# Altium schematic sheet CM_POWER_TREE.SchDoc
size Tabloid; SheetNumber: 2; SheetTotal: 14; Sheet_Name: Power tree
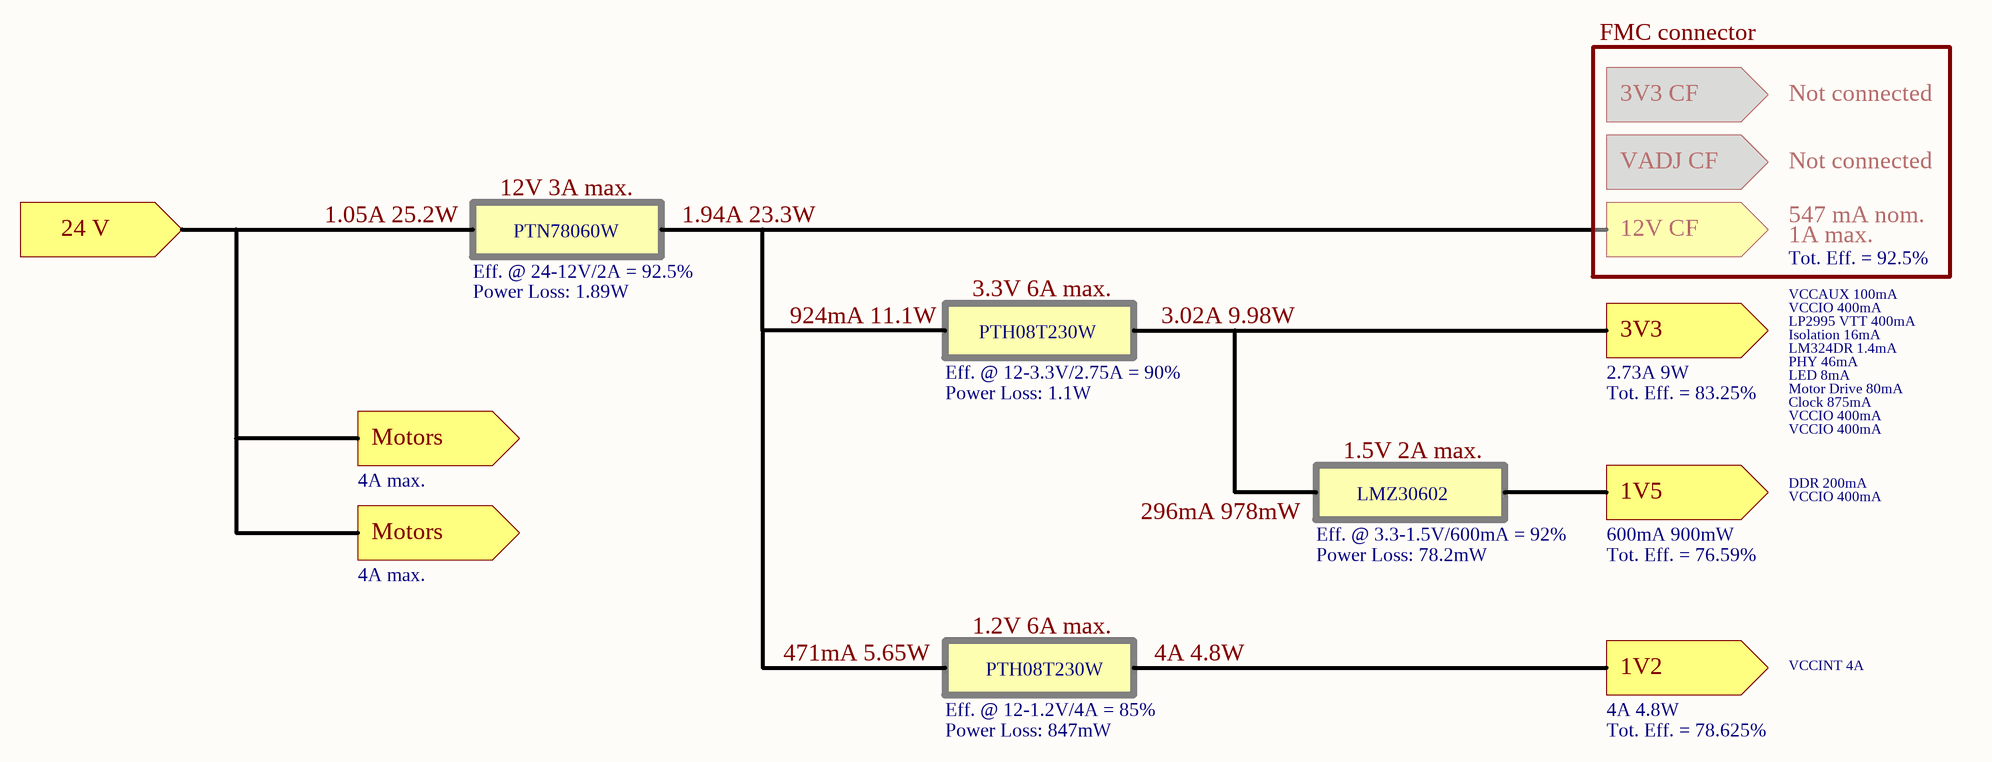
[diagram p0: CM_POWER_TREE.SchDoc]

## Notes on the sheet
- FMC connector
- 3V3 CF
- Not connected
- 12V 3A max.
- VADJ CF
- 24 V
- 1.05A 25.2W
- PTN78060W
- 1.94A 23.3W
- 12V CF
- 1A max.
- 547 mA nom.
- Tot. Eff. = 92.5%
- Eff. @ 24-12V/2A = 92.5%
- Power Loss: 1.89W
- 924mA 11.1W
- 3.3V 6A max.
- PTH08T230W
- 3.02A 9.98W
- 3V3
- VCCAUX 100mA
- VCCIO 400mA
- LP2995 VTT 400mA
- Isolation 16mA
- Eff. @ 12-3.3V/2.75A = 90%
- Power Loss: 1.1W
- Tot. Eff. = 83.25%
- 2.73A 9W
- LM324DR 1.4mA
- PHY 46mA
- LED 8mA
- Motor Drive 80mA
- Motors
- 1.5V 2A max.
- Clock 875mA
- 4A max.
- 296mA 978mW
- LMZ30602
- 1V5
- DDR 200mA
- Eff. @ 3.3-1.5V/600mA = 92%
- Power Loss: 78.2mW
- Tot. Eff. = 76.59%
- 600mA 900mW
- 471mA 5.65W
- 1.2V 6A max.
- 4A 4.8W
- VCCINT 4A
- Power Loss: 847mW
- Eff. @ 12-1.2V/4A = 85%
- Tot. Eff. = 78.625%
- 1V2
- Sheet Name
- Project Title
- Global Project
- Size
- Group
- Revision
- Date
- Sheet
- of
- Filename
- Designers